# Altium schematic sheet S7CAS-PLEIADES-CARTE-MERE_P20_Power-Tree-3.SchDoc
size Tabloid; SheetNumber: 5; SheetTotal: 20; Sheet_Name: Power Tree 3/3; Size: 11x17
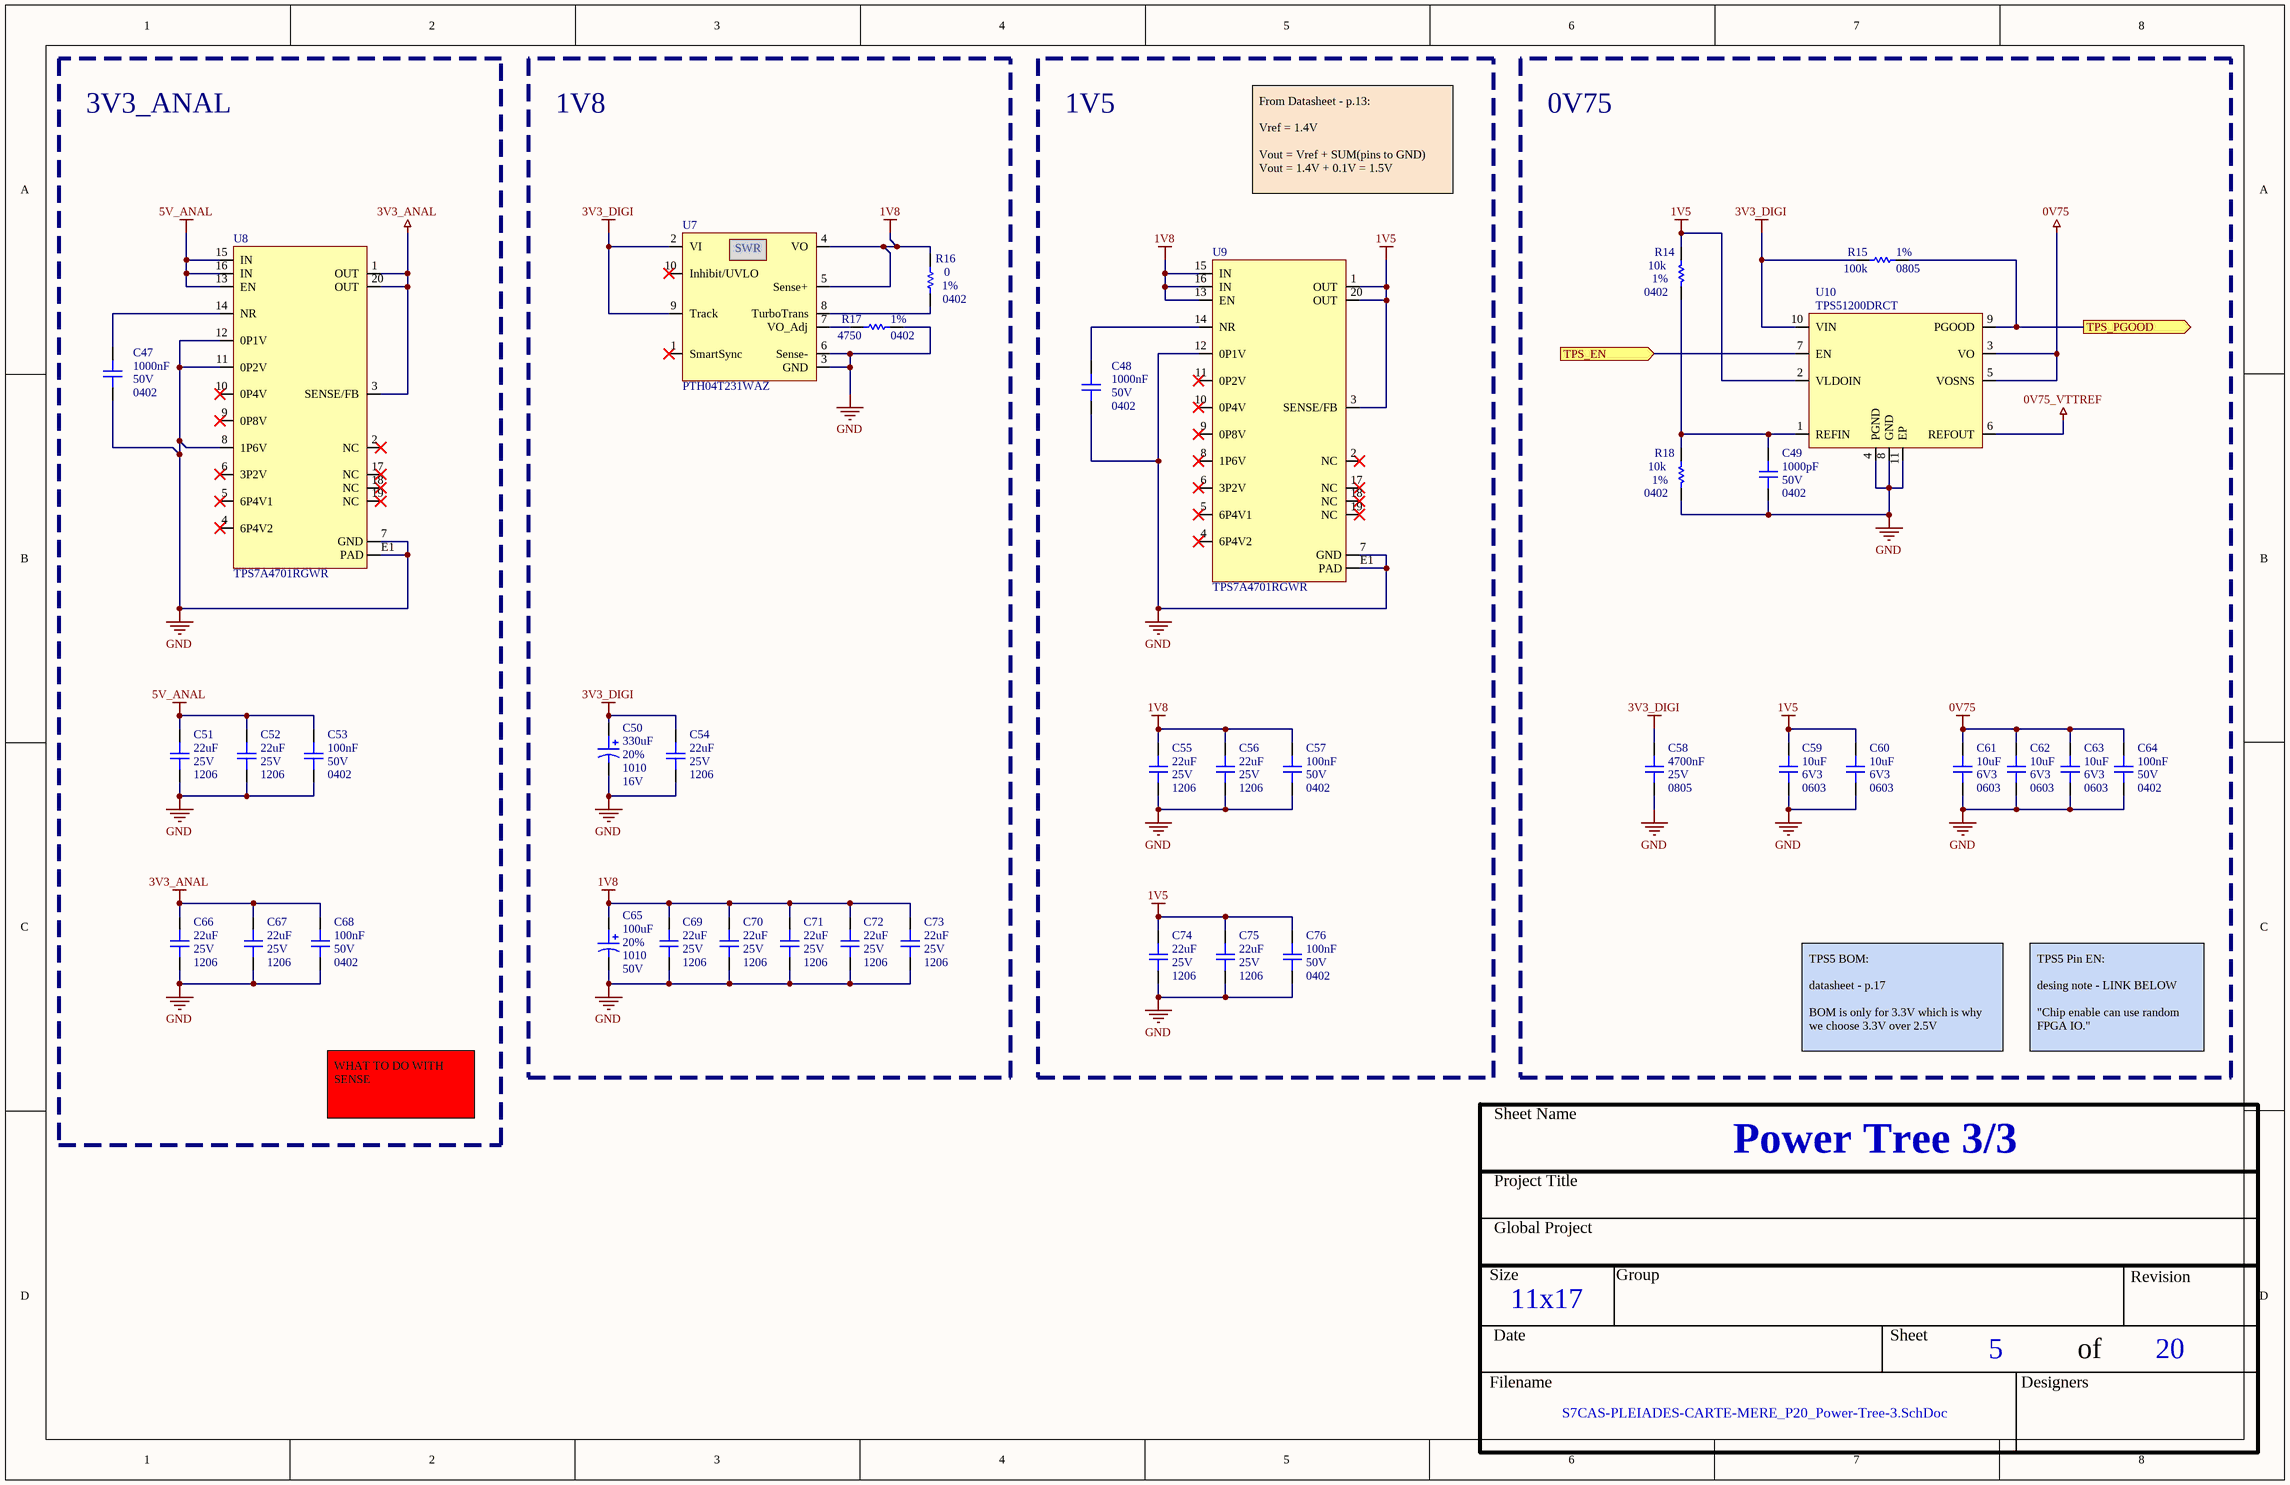
[diagram p0: S7CAS-PLEIADES-CARTE-MERE_P20_Power-Tree-3.SchDoc]

## Parts
C47  value 1000nF  Voltage: 50V  Package: 0402  [CAP_0402]  (hidden comment: CAP - 0402)
C48  value 1000nF  Voltage: 50V  Package: 0402  [CAP_0402]  (hidden comment: CAP - 0402)
C49  value 1000pF  Voltage: 50V  Package: 0402  [CAP_0201]  (hidden comment: CAP - 0201)
C50  value 330uF  Voltage: 16V  Package: 1010  Precision: 20%  [CAP_ALU_1010_vishay]  (hidden comment: MAL214699501E3)
C51  value 22uF  Voltage: 25V  Package: 1206  [CAP_1206]  (hidden comment: CAP - 1206)
C52  value 22uF  Voltage: 25V  Package: 1206  [CAP_1206]  (hidden comment: CAP - 1206)
C53  value 100nF  Voltage: 50V  Package: 0402  [CAP_0402]  (hidden comment: CAP - 0402)
C54  value 22uF  Voltage: 25V  Package: 1206  [CAP_1206]  (hidden comment: CAP - 1206)
C55  value 22uF  Voltage: 25V  Package: 1206  [CAP_1206]  (hidden comment: CAP - 1206)
C56  value 22uF  Voltage: 25V  Package: 1206  [CAP_1206]  (hidden comment: CAP - 1206)
C57  value 100nF  Voltage: 50V  Package: 0402  [CAP_0402]  (hidden comment: CAP - 0402)
C58  value 4700nF  Voltage: 25V  Package: 0805  [CAP_0805]  (hidden comment: CAP - 0805)
C59  value 10uF  Voltage: 6V3  Package: 0603  [CAP_0603]  (hidden comment: CAP - 0603)
C60  value 10uF  Voltage: 6V3  Package: 0603  [CAP_0603]  (hidden comment: CAP - 0603)
C61  value 10uF  Voltage: 6V3  Package: 0603  [CAP_0603]  (hidden comment: CAP - 0603)
C62  value 10uF  Voltage: 6V3  Package: 0603  [CAP_0603]  (hidden comment: CAP - 0603)
C63  value 10uF  Voltage: 6V3  Package: 0603  [CAP_0603]  (hidden comment: CAP - 0603)
C64  value 100nF  Voltage: 50V  Package: 0402  [CAP_0402]  (hidden comment: CAP - 0402)
C65  value 100uF  Voltage: 50V  Package: 1010  Precision: 20%  [CAP_ALU_1010_vishay]  (hidden comment: MAL215099101E3)
C66  value 22uF  Voltage: 25V  Package: 1206  [CAP_1206]  (hidden comment: CAP - 1206)
C67  value 22uF  Voltage: 25V  Package: 1206  [CAP_1206]  (hidden comment: CAP - 1206)
C68  value 100nF  Voltage: 50V  Package: 0402  [CAP_0402]  (hidden comment: CAP - 0402)
C69  value 22uF  Voltage: 25V  Package: 1206  [CAP_1206]  (hidden comment: CAP - 1206)
C70  value 22uF  Voltage: 25V  Package: 1206  [CAP_1206]  (hidden comment: CAP - 1206)
C71  value 22uF  Voltage: 25V  Package: 1206  [CAP_1206]  (hidden comment: CAP - 1206)
C72  value 22uF  Voltage: 25V  Package: 1206  [CAP_1206]  (hidden comment: CAP - 1206)
C73  value 22uF  Voltage: 25V  Package: 1206  [CAP_1206]  (hidden comment: CAP - 1206)
C74  value 22uF  Voltage: 25V  Package: 1206  [CAP_1206]  (hidden comment: CAP - 1206)
C75  value 22uF  Voltage: 25V  Package: 1206  [CAP_1206]  (hidden comment: CAP - 1206)
C76  value 100nF  Voltage: 50V  Package: 0402  [CAP_0402]  (hidden comment: CAP - 0402)
R14  value 10k  Package: 0402  Precision: 1%  [RES_0402]  (hidden comment: RES - 0402)
R15  value 100k  Package: 0805  Precision: 1%  [RES_0805]  (hidden comment: RES - 0805)
R16  value 0  Package: 0402  Precision: 1%  [RES_0402]  (hidden comment: RES - 0402)
R17  value 4750  Package: 0402  Precision: 1%  [RES_0402]  (hidden comment: RES - 0402)
R18  value 10k  Package: 0402  Precision: 1%  [RES_0402]  (hidden comment: RES - 0402)
U7  PTH04T231WAZ  [REG_SWR_PTH04T231WAZ]
U8  TPS7A4701RGWR  [REG_TPS7A4701RGWR]
U9  TPS7A4701RGWR  [REG_TPS7A4701RGWR]
U10  TPS51200DRCT  [REG_PMIC_TPS51200DRCT]

## Blocks framed on the sheet
3V3_ANAL: C47 C51-C53 C66-C68 U8
1V8: C50 C54 C65 C69-C73 R16 R17 U7
1V5: C48 C55-C57 C74-C76 U9
0V75: C49 C58-C64 R14 R15 R18 U10

## Ports
TPS_EN (in), TPS_PGOOD (out)

## Nets
0V75: C61.2 C62.2 C63.2 C64.2 U10.3(VO) U10.5(VOSNS)
0V75_VTTREF: U10.6(REFOUT)
1V5: C59.2 C60.2 C74.2 C75.2 C76.2 R14.2 U9.1(OUT) U9.3(SENSE/FB) U9.20(OUT) U10.2(VLDOIN)
1V8: C55.2 C56.2 C57.2 C65.1 C69.2 C70.2 C71.2 C72.2 C73.2 R16.2 U7.4(VO) U7.5(Sense+) U9.13(EN) U9.15(IN) U9.16(IN)
3V3_ANAL: C66.2 C67.2 C68.2 U8.1(OUT) U8.3(SENSE/FB) U8.20(OUT)
3V3_DIGI: C50.1 C54.2 C58.2 R15.2 U7.2(VI) U7.9(Track) U10.10(VIN)
5V_ANAL: C51.2 C52.2 C53.2 U8.13(EN) U8.15(IN) U8.16(IN)
GND: C47.2 C48.2 C49.1 C50.2 C51.1 C52.1 C53.1 C54.1 C55.1 C56.1 C57.1 C58.1 C59.1 C60.1 C61.1 C62.1 C63.1 C64.1 C65.2 C66.1 C67.1 C68.1 C69.1 C70.1 C71.1 C72.1 C73.1 C74.1 C75.1 C76.1 R17.1 R18.1 U7.3(GND) U7.6(Sense-) U8.7(GND) U8.8(1P6V) U8.11(0P2V) U8.12(0P1V) U8.E1(PAD) U9.7(GND) U9.12(0P1V) U9.E1(PAD) U10.4(PGND) U10.8(GND) U10.11(EP)
TPS_EN: U10.7(EN) ; port TPS_EN
TPS_PGOOD: R15.1 U10.9(PGOOD) ; port TPS_PGOOD
NetC47_1: C47.1 U8.14(NR)
NetC48_1: C48.1 U9.14(NR)
NetC49_2: C49.2 R14.1 R18.2 U10.1(REFIN)
NetR16_1: R16.1 U7.8(TurboTrans)
NetR17_2: R17.2 U7.7(VO_Adj)

Not connected (* = marked no-connect by the designer): U7 1(SmartSync)* 10(Inhibit/UVLO)*; U8 2(NC)* 4(6P4V2)* 5(6P4V1)* 6(3P2V)* 9(0P8V)* 10(0P4V)* 17(NC)* 18(NC)* 19(NC)*; U9 2(NC)* 4(6P4V2)* 5(6P4V1)* 6(3P2V)* 8(1P6V)* 9(0P8V)* 10(0P4V)* 11(0P2V)* 17(NC)* 18(NC)* 19(NC)*

## Notes on the sheet
- From Datasheet - p.13:
  Vref = 1.4V
  Vout = Vref + SUM(pins to GND)
  Vout = 1.4V + 0.1V = 1.5V
- TPS5 BOM:
  datasheet - p.17
  BOM is only for 3.3V which is why we choose 3.3V over 2.5V
- TPS5 Pin EN:
  desing note - LINK BELOW
  "Chip enable can use random FPGA IO."
  https://e2e.ti.com/support/power-management-group/power-management/f/power-management-forum/981448/tps51200-about-slp_s3-in-ddr3-application
- WHAT TO DO WITH SENSE
- Sheet Name
- Project Title
- Global Project
- Size
- Group
- Revision
- Date
- Sheet
- of
- Filename
- Designers
- (in symbol REG_SWR_PTH04T231WAZ) SWR

## Library data of the parts
C47 C48 = CAP - 0402: Mfg Part Number: GXT155R61E105KE01; Precision: 10%; Current: *; CreatedBy: Jonathan Bouchard; Power: *
C49 = CAP - 0201: Mfg Part Number: GRM0335C1H102JE01; Precision: 10%; Current: *; CreatedBy: Jonathan Bouchard; Power: *
C50 = CAP_ALU_MAL214699501E3: CAP - ALU 330uF 20% 16V - 1010; Current: 750mA; Mfg: Vishay Dale; Mfg Part Number: MAL214699501E3; HelpURL: http://www.vishay.com/docs/28403/146cti.pdf; CreatedBy: Jonathan Bouchard; Temperature: -55°C to 125°C; Power: *; Supplier 1: Digikey; Supplier Part Number 1: 4405PHCT-ND
C51 C52 C54-C56 C66 C67 C69-C75 = CAP - 1206: Mfg Part Number: GRM31CC81E226KE11; Precision: 10%; Current: *; HelpURL: https://search.murata.co.jp/Ceramy/image/img/A01X/G101/ENG/GRM31CD71H106KE11-01A.pdf; CreatedBy: Jonathan Bouchard; Power: *
C53 C57 C64 C68 C76 = CAP - 0402: Mfg Part Number: GRM155R61H104KE14; Precision: 10%; Current: *; CreatedBy: Jonathan Bouchard; Power: *
C58 = CAP - 0805: Mfg Part Number: GRM219R61E475KA73; Precision: 10%; Current: *; CreatedBy: Jonathan Bouchard; Power: *
C59-C63 = CAP - 0603: Mfg Part Number: GRM185R60J106ME15; Precision: 20%; Current: *; CreatedBy: Jonathan Bouchard; Power: *
C65 = CAP_ALU_MAL215099101E3: CAP - ALU 100uF 20% 50V - 1010; Current: 490mA; Mfg: Vishay Dale; Mfg Part Number: MAL215099101E3; HelpURL: http://www.vishay.com/docs/28395/150crz.pdf; CreatedBy: Jonathan Bouchard; Temperature: -55°C to 125°C; Power: *; Supplier 1: Digikey; Supplier Part Number 1: 4399PHDKR-ND
R14 R18 = RES - 0402: Mfg Part Number: MCS04020C1002FE000; Voltage: 50V; Power: 1/16W; Current: *; CreatedBy: Jonathan Bouchard
R15 = RES - 0805: Mfg Part Number: CRM0805-FX-1003ELF; Current: *; CreatedBy: Jonathan Bouchard
R16 = RES - 0402: Mfg Part Number: CR200000F; Voltage: 50V; Power: 1/16W; Current: *; CreatedBy: Jonathan Bouchard
R17 = RES - 0402: Mfg Part Number: CR0402-FX-4751GLF; Voltage: 50V; Power: 1/16W; Current: *; CreatedBy: Jonathan Bouchard
U7 = REG_SWR_PTH04T231WAZ: REG - MODULE PIP 6A 2.2V/5.5V - 10SMD; Manufacturer #1: Texas Instruments; Current Rating: 6A (out); Value: 0.69 - 3.6V (Out); Voltage rating: 2.2-5.5V (Input); Polarized: Yes; Magnetic Material: UNKNOWN; Manufacturer #2: *; Note: *; Power Max: *; Part Number #1: PTH04T231WAZ; Part Number #2: *; HelpURL: http://www.ti.com/lit/ds/symlink/pth04t231w.pdf; Supplier 1: Digi-Key; Assembly Type: SMD; Temperature: -40°C ~ 85°C; Supplier Part Number 1: 296-21792-ND; Package: SMD; CreatedBy/Date: Olivier Bernard / 6/5/2018; VerifiedBy: Caroline Paulin / 10 juillet 2018; Cryo: UNKNOWN; Mfg Part Number: PTH04T231WAZ
U8 U9 = REG_LDO_TPS7A4701RGWR: REG - LINEAR POS ADJ 1A - 20VQFN; Manufacturer #1: Texas Instruments; GRAMS Lib Spec: 2.8; Magnetic Material: Unknown; Polarized: Yes; Value: 1.4 à 34V; Voltage rating: 35V max; Assembly Type: SMD; CreatedBy/Date: L-P Gauthier / 2018-05-29; Current Rating: 1A; Manufacturer #2: TBD; Part Number #1: TPS7A4701RGWR; Part Number #2: TBD; Package: 20-VQFN Exposed Pad; Power Max: *; Tolerance: -; Supplier 1: Digi-Key; Supplier Part Number 1: 296-37224-1-ND; VerifiedBy: Caroline Paulin - 28 sept 2018; Temperature: -40°C ~ 125°C; HelpURL: http://www.ti.com/lit/ds/symlink/tps7a47.pdf; Cryo: UNKNOWN; Mfg Part Number: TPS7A4701RGWR
U10 = REG_PMIC_TPS51200DRCT: REG - DDR TERMINATION/REF REG - 10-VFDFN; Manufacturer #1: Texas Instruments; Value: DDR, DDR2, DDR3(L), DDR4; Voltage Rating: 2.375V ~ 3.5V; Current Rating: Source: 3A~4.5A, Sink: 3.5A~5.5A; GRAMS Lib Spec: 2.8; Magnetic Material: Unknown; Polarized: Yes; Tolerance: *; Power Max: *; HelpURL: http://www.ti.com/lit/ds/symlink/tps51200.pdf; CreatedBy/Date: Joel Lemay 2019-03-19; VerifiedBy: Nicolas V. (2019-05-31); Temperature: -40°C ~ 85°C; Package: 10-VFDFN; Manufacturer #2: *; Note: *; Assembly Type: SMD; Part Number #2: *; Part Number #1: TPS51200DRCT; Supplier 1: Digi-Key; Supplier Part Number 1: 296-23830-1-ND; Cryo: UNKNOWN; Mfg Part Number: TPS51200DRCT